# EAGLE design al3lg (EAGLE 7.2.0)

## Sheet 1 of 3
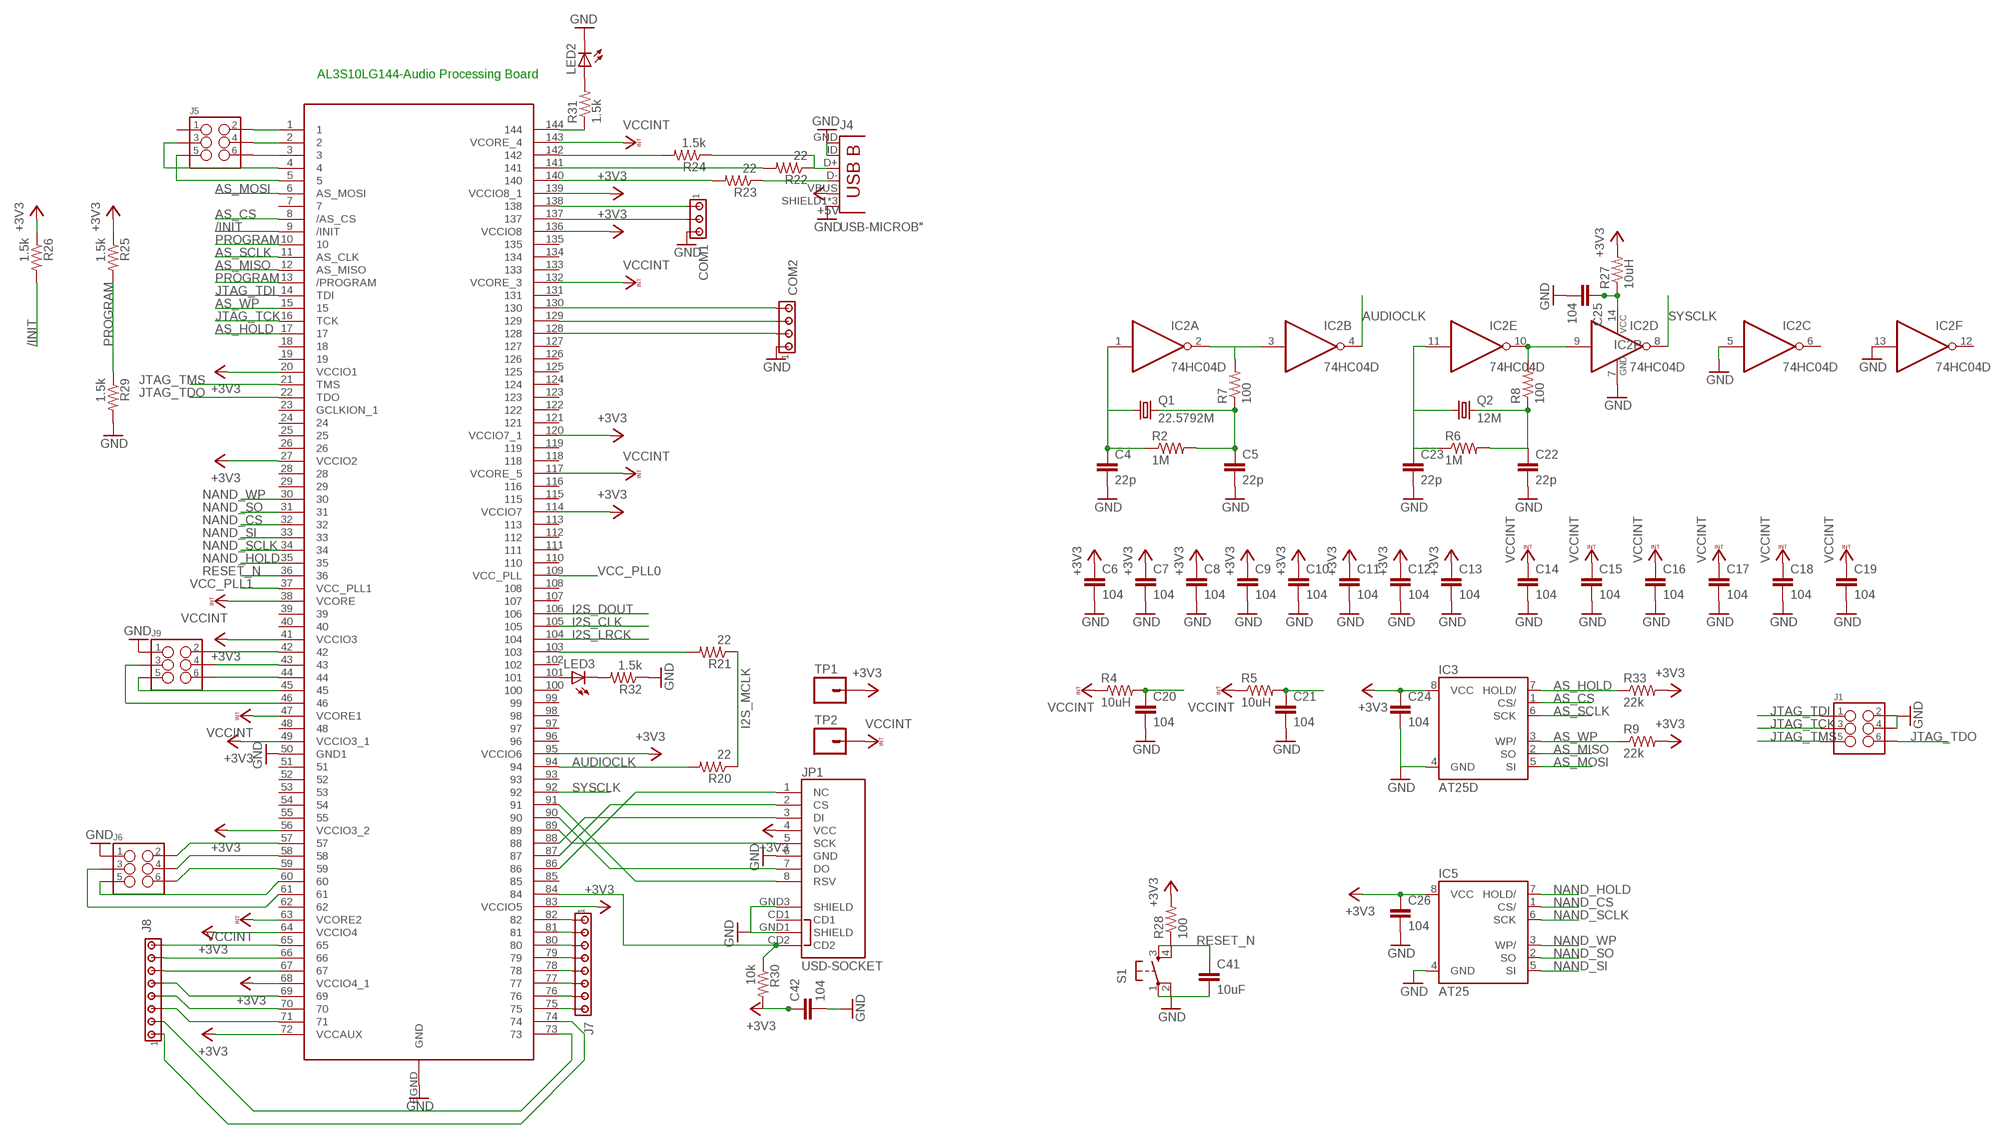
[diagram p0: schematic, sheet 1]

### Parts
C4  22p  C-EUC0805  [C0805]
C5  22p  C-EUC0805  [C0805]
C6  104  C-EUC0805  [C0805]
C7  104  C-EUC0805  [C0805]
C8  104  C-EUC0805  [C0805]
C9  104  C-EUC0805  [C0805]
C10  104  C-EUC0805  [C0805]
C11  104  C-EUC0805  [C0805]
C12  104  C-EUC0805  [C0805]
C13  104  C-EUC0805  [C0805]
C14  104  C-EUC0805  [C0805]
C15  104  C-EUC0805  [C0805]
C16  104  C-EUC0805  [C0805]
C17  104  C-EUC0805  [C0805]
C18  104  C-EUC0805  [C0805]
C19  104  C-EUC0805  [C0805]
C20  104  C-EUC0805  [C0805]
C21  104  C-EUC0805  [C0805]
C22  22p  C-EUC0805  [C0805]
C23  22p  C-EUC0805  [C0805]
C24  104  C-EUC0805  [C0805]
C25  104  C-EUC0805  [C0805]
C26  104  C-EUC0805  [C0805]
C41  10uF  C-EUC0805  [C0805]
C42  104  C-EUC0805  [C0805]
COM1  MTA03-100  [10X03MTA]
COM2  MTA04-100  [10X04MTA]
IC2  74HC04D  [SO14]
IC3  AT25D  [SOIC8]
IC5  AT25  [WSON8]
J1  M03X22X3_SILK_MALE_PTH  [2X3]
J4  USB-MICROB"  [USB-B-MICRO-SMD_V03]
J5  M03X22X3_SILK_MALE_PTH  [2X3]
J6  M03X22X3_SILK_MALE_PTH  [2X3]
J7  MTA08-100  [10X08MTA]
J8  MTA08-100  [10X08MTA]
J9  M03X22X3_SILK_MALE_PTH  [2X3]
JP1  USD-SOCKET  [MICROSD_1:1]
LED2  LEDSML0805  [SML0805]
LED3  LEDSML0805  [SML0805]
Q1  22.5792M  CRYSTALHC49S  [HC49/S]
Q2  12M  CRYSTALHC49S  [HC49/S]
R2  1M  R-US_M0805  [M0805]
R4  10uH  R-US_M0805  [M0805]
R5  10uH  R-US_M0805  [M0805]
R6  1M  R-US_M0805  [M0805]
R7  100  R-US_M0805  [M0805]
R8  100  R-US_M0805  [M0805]
R9  22k  R-US_M0805  [M0805]
R20  22  R-US_M0805  [M0805]
R21  22  R-US_M0805  [M0805]
R22  22  R-US_M0805  [M0805]
R23  22  R-US_M0805  [M0805]
R24  1.5k  R-US_M0805  [M0805]
R25  1.5k  R-US_M0805  [M0805]
R26  1.5k  R-US_M0805  [M0805]
R27  10uH  R-US_M0805  [M0805]
R28  100  R-US_M0805  [M0805]
R29  1.5k  R-US_M0805  [M0805]
R30  10k  R-US_M0805  [M0805]
R31  1.5k  R-US_R0805  [R0805]
R32  1.5k  R-US_R0805  [R0805]
R33  22k  R-US_M0805  [M0805]
S1  10-XXSMD  [B3F-10SMD]
TP1  M01  [0805SMD]
TP2  M01  [0805SMD]
U1  AL3S10LG144  [HLQFP144NT16]

### Nets
+3V3: C6.1 C7.1 C8.1 C9.1 C10.1 C11.1 C12.1 C13.1 C24.1 C26.1 C42.1 IC3.8(VCC) IC5.8(VCC) JP1.4(VCC) R9.2 R25.1 R26.1 R27.2 R28.2 R30.2 R33.2 TP1.1 U1.20(VCCIO1) U1.27(VCCIO2) U1.41(VCCIO3) U1.49(VCCIO3_1) U1.56(VCCIO3_2) U1.64(VCCIO4) U1.68(VCCIO4_1) U1.72(VCCAUX) U1.83(VCCIO5) U1.95(VCCIO6) U1.114(VCCIO7) U1.120(VCCIO7_1) U1.136(VCCIO8) U1.139(VCCIO8_1) ; also sheet 2
+5V: J4.VBUS ; also sheet 2,3
/INIT: R26.2 U1.9(/INIT)
AS_CS: IC3.1(CS/) U1.8(/AS_CS)
AS_HOLD: IC3.7(HOLD/) R33.1 U1.17
AS_MISO: IC3.2(SO) U1.12(AS_MISO)
AS_MOSI: IC3.5(SI) U1.6(AS_MOSI)
AS_SCLK: IC3.6(SCK) U1.11(AS_CLK)
AS_WP: IC3.3(WP/) R9.1 U1.15
AUDIOCLK: IC2.4(B:O) R20.2 U1.94
DI: J6.4 U1.58
DI1: J9.4 U1.43
DO: J6.2 U1.57
DO1: J9.2 U1.42
GND: C4.2 C5.2 C6.2 C7.2 C8.2 C9.2 C10.2 C11.2 C12.2 C13.2 C14.2 C15.2 C16.2 C17.2 C18.2 C19.2 C20.2 C21.2 C22.2 C23.2 C24.2 C25.2 C26.2 C41.2 C42.2 COM1.3 COM2.1 IC2.5(C:I) IC2.7(P:GND) IC2.13(F:I) IC3.4(GND) IC5.4(GND) J1.2 J1.4 J4.GND J4.ID(USBID) J4.SHIELD1(SHIELD) J4.SHIELD2(SHIELD) J4.SHIELD3(SHIELD) J6.1 J9.1 JP1.6(GND) JP1.GND1(SHIELD) JP1.GND3(SHIELD) LED2.C R29.2 R32.1 S1.1(P) S1.2(P1) U1.50(GND1) U1.EGND(GND) ; also sheet 2,3
I2S_CLK: U1.105 ; also sheet 3
I2S_DOUT: U1.106 ; also sheet 3
I2S_LRCK: U1.104 ; also sheet 3
I2S_MCLK: R20.1 R21.1 ; also sheet 3
JTAG_TCK: J1.3 U1.16(TCK)
JTAG_TDI: J1.1 U1.14(TDI)
JTAG_TDO: J1.6 U1.22(TDO)
JTAG_TMS: J1.5 U1.21(TMS)
LRCLK: J6.6 U1.59
LRCLK1: J9.6 U1.44
MCLK: J6.5 U1.60
MCLK1: J9.5 U1.45
N$2: C4.1 IC2.1(A:I) Q1.1 R2.1
N$3: C5.1 Q1.2 R2.2 R7.1
N$5: C23.1 IC2.11(E:I) Q2.1 R6.1
N$7: IC2.2(A:O) IC2.3(B:I) R7.2
N$8: C22.1 Q2.2 R6.2 R8.1
N$9: IC2.9(D:I) IC2.10(E:O) R8.2
N$25: R21.2 U1.103
N$26: R24.2 U1.142
N$27: J4.D+ R22.1 R24.1
N$28: R22.2 U1.141
N$29: R23.2 U1.140
N$30: J4.D- R23.1
N$31: COM1.1 U1.138
N$34: COM1.2 U1.137
N$35: C25.1 IC2.14(P:VCC) R27.1
N$37: J8.8 U1.65
N$38: J8.7 U1.66
N$39: J8.6 U1.67
N$40: J8.2 U1.73
N$41: J8.5 U1.69
N$42: J8.4 U1.70
N$43: J8.3 U1.71
N$45: J8.1 U1.74
N$46: J7.1 U1.82
N$47: J7.2 U1.81
N$48: J7.3 U1.80
N$49: J7.4 U1.79
N$50: J7.5 U1.78
N$51: J7.6 U1.77
N$52: J7.7 U1.76
N$53: JP1.CD2 R30.1 U1.84
N$54: JP1.8(RSV) U1.91
N$55: JP1.7(DO) U1.90
N$56: JP1.5(SCK) U1.89
N$57: JP1.3(DI) U1.88
N$58: JP1.2(CS) U1.87
N$59: JP1.1(NC) U1.86
N$60: COM2.4 U1.130
N$61: COM2.3 U1.129
N$62: COM2.2 U1.128
N$63: LED2.A R31.2
N$64: R31.1 U1.144
N$65: J5.2 U1.1
N$66: J5.4 U1.2
N$67: J5.6 U1.3
N$68: J5.3 U1.4
N$69: J5.5 U1.5
N$70: LED3.A U1.101
N$71: LED3.C R32.2
N$72: J7.8 U1.75
NAND_CS: IC5.1(CS/) U1.32
NAND_HOLD: IC5.7(HOLD/) U1.35
NAND_SCLK: IC5.6(SCK) U1.34
NAND_SI: IC5.5(SI) U1.33
NAND_SO: IC5.2(SO) U1.31
NAND_WP: IC5.3(WP/) U1.30
PROGRAM: R25.2 R29.1 U1.10 U1.13(/PROGRAM)
RESET_N: C41.1 R28.1 S1.3(S) S1.4(S1) U1.36
SCLK: J6.3 U1.61
SCLK1: J9.3 U1.46
SYSCLK: IC2.8(D:O) U1.92
VCC_PLL0: C21.1 R5.2 U1.109(VCC_PLL)
VCC_PLL1: C20.1 R4.2 U1.37(VCC_PLL1)
VCCINT: C14.1 C15.1 C16.1 C17.1 C18.1 C19.1 R4.1 R5.1 TP2.1 U1.38(VCORE) U1.47(VCORE1) U1.63(VCORE2) U1.117(VCORE_5) U1.132(VCORE_3) U1.143(VCORE_4) ; also sheet 2
Unconnected: IC2.6(C:O) IC2.12(F:O) J5.1 JP1.CD1 U1.7 U1.18 U1.19 U1.23(GCLKION_1) U1.24 U1.25 U1.26 U1.28 U1.29 U1.39 U1.40 U1.48 U1.51 U1.52 U1.53 U1.54 U1.55 U1.62 U1.85 U1.93 U1.96 U1.97 U1.98 U1.99 U1.100 U1.102 U1.107 U1.108 U1.110 U1.111 U1.112 U1.113 U1.115 U1.116 U1.118 U1.119 U1.121 U1.122 U1.123 U1.124 U1.125 U1.126 U1.127 U1.131 U1.133 U1.134 U1.135

### Notes on the sheet
- AL3S10LG144-Audio Processing Board

## Sheet 2 of 3
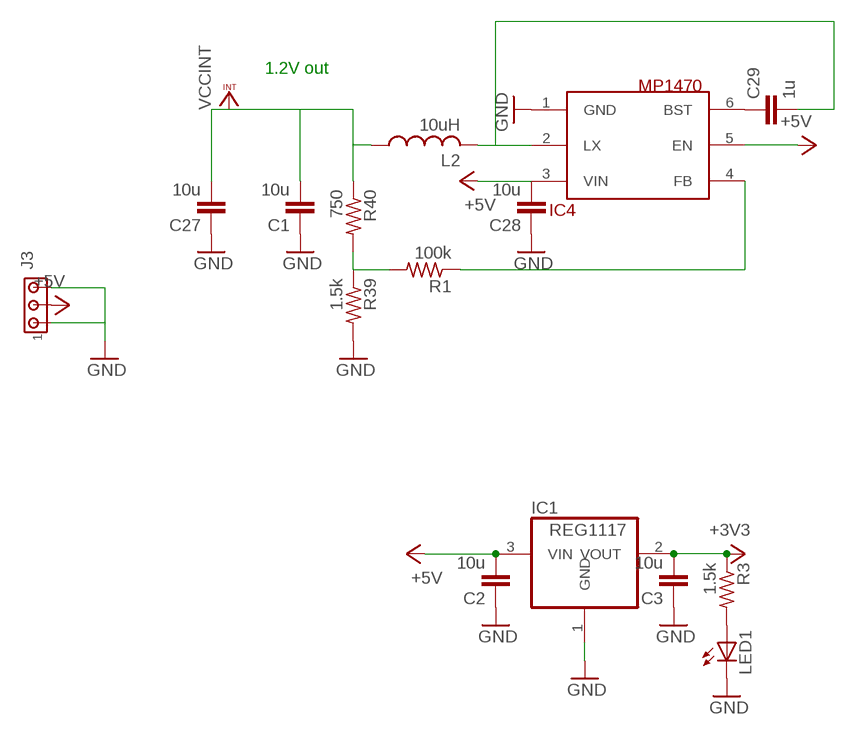
[diagram p1: schematic, sheet 2]

### Parts
C1  10u  C-EUC0805  [C0805]
C2  10u  C-EUC0805  [C0805]
C3  10u  C-EUC0805  [C0805]
C27  10u  C-EUC0805  [C0805]
C28  10u  C-EUC0805  [C0805]
C29  1u  C-EUC0805  [C0805]
IC1  REG1117  [SOT223]
IC4  MP1470  [SOT23-6L]
J3  MTA03-100  [10X03MTA]
L2  10uH  L-USL4532P  [L4532P]
LED1  LEDSML0805  [SML0805]
R1  100k  R-US_R0805  [R0805]
R3  1.5k  R-US_R0805  [R0805]
R39  1.5k  R-US_R0805  [R0805]
R40  750  R-US_R0805  [R0805]

### Nets
+3V3: C3.2 IC1.2(VOUT) R3.1 ; also sheet 1
+5V: C2.2 C28.2 IC1.3(VIN) IC4.3(VIN) IC4.5(EN) J3.2 ; also sheet 1,3
GND: C1.1 C2.1 C3.1 C27.1 C28.1 IC1.1(GND) IC4.1(GND) J3.1 J3.3 LED1.C R39.2 ; also sheet 1,3
N$1: R1.2 R39.1 R40.2
N$4: LED1.A R3.2
N$32: C29.2 IC4.2(LX) L2.2
N$33: C29.1 IC4.6(BST)
N$36: IC4.4(FB) R1.1
VCCINT: C1.2 C27.2 L2.1 R40.1 ; also sheet 1

### Notes on the sheet
- 1.2V out

## Sheet 3 of 3
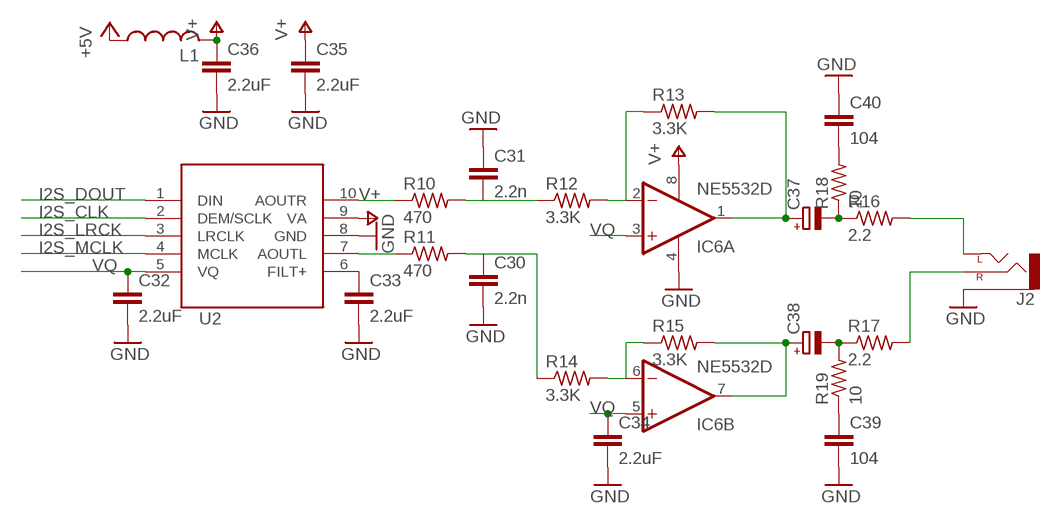
[diagram p2: schematic, sheet 3]

### Parts
C30  2.2n  C-EUC0805  [C0805]
C31  2.2n  C-EUC0805  [C0805]
C32  2.2uF  C-EUC0805  [C0805]
C33  2.2uF  C-EUC0805  [C0805]
C34  2.2uF  C-EUC0805  [C0805]
C35  2.2uF  C-EUC0805  [C0805]
C36  2.2uF  C-EUC0805  [C0805]
C37  CPOL-EUE2.5-7  [E2,5-7]
C38  CPOL-EUE2.5-7  [E2,5-7]
C39  104  C-EUC0805  [C0805]
C40  104  C-EUC0805  [C0805]
IC6  NE5532D  [SO08]
J2  AUDIO-JACKPTH  [AUDIO-JACK]
L1  L-USL4532P  [L4532P]
R10  470  R-US_R0805  [R0805]
R11  470  R-US_R0805  [R0805]
R12  3.3K  R-US_R0805  [R0805]
R13  3.3K  R-US_R0805  [R0805]
R14  3.3K  R-US_R0805  [R0805]
R15  3.3K  R-US_R0805  [R0805]
R16  2.2  R-US_R0805  [R0805]
R17  2.2  R-US_R0805  [R0805]
R18  10  R-US_R0805  [R0805]
R19  10  R-US_R0805  [R0805]
U2  CS4344  [TSSOP10]

### Nets
+5V: L1.1 ; also sheet 1,2
GND: C30.2 C31.1 C32.2 C33.2 C34.2 C35.2 C36.2 C39.2 C40.1 IC6.4(P:V-) J2.SLEEVE U2.8(GND) ; also sheet 1,2
I2S_CLK: U2.2(DEM/SCLK) ; also sheet 1
I2S_DOUT: U2.1(DIN) ; also sheet 1
I2S_LRCK: U2.3(LRCLK) ; also sheet 1
I2S_MCLK: U2.4(MCLK) ; also sheet 1
N$10: R11.1 U2.7(AOUTL)
N$11: C30.1 R11.2 R14.1
N$12: R10.1 U2.10(AOUTR)
N$13: C31.2 R10.2 R12.1
N$14: IC6.2(A:-IN) R12.2 R13.1
N$15: C37.+ IC6.1(A:OUT) R13.2
N$16: IC6.6(B:-IN) R14.2 R15.1
N$17: C38.+ IC6.7(B:OUT) R15.2
N$18: C33.1 U2.6(FILT+)
N$19: C37.- R16.1 R18.1
N$20: C38.- R17.1 R19.2
N$21: J2.TIP(LEFT) R16.2
N$22: J2.RING(RIGHT) R17.2
N$23: C39.1 R19.1
N$24: C40.2 R18.2
V+: C35.1 C36.1 IC6.8(P:V+) L1.2 U2.9(VA)
VQ: C32.1 C34.1 IC6.3(A:+IN) IC6.5(B:+IN) U2.5(VQ)

### Notes on the sheet
- U2

## Library data of the parts
C1-C36 C39-C42 = rcl:C-EU: CAPACITOR, European symbol
C37 C38 = rcl:CPOL-EU: POLARIZED CAPACITOR, European symbol
COM1 J3 = con-amp:MTA03-100: AMP connector
COM2 = con-amp:MTA04-100: AMP connector
IC1 = burr-brown:REG1117: 800mA and 1A Low Dropout (LDO) Positive Regulator 1.8V, 2.5V, 2.85V, 3.3V, 5V, and Adj; MPN: REG1117; OC_FARNELL: 1097566; OC_NEWARK: 14P6981
IC2 = 74xx-eu:74*04: Hex INVERTER
IC3 IC5 = atmel:AT25*: SPI bus serial EEPROM
IC4 = maxim:MP1470
IC6 = linear:NE5532: AUDIO AMPLIFIER
J1 J5 J6 J9 = SparkFun-Connectors:M03X2: 2x3 .1" header. Shrouded, with keying- CONN-10681 SMT- CONN-11415 Pogo pins- HW-11044; PROD_ID: CONN-09701
J2 = SparkFun-Connectors:AUDIO-JACK: 3.5mm Audio Jack Simple 3.5mm common PCB mount audio jack. Variant PTH is our storefront SKU PRT-08032
J4 = SparkFun-Connectors:USB-MICROB; PROD_ID: CONN-11752
J7 J8 = con-amp:MTA08-100: AMP connector
JP1 = SparkFun-Connectors:USD-SOCKET: microSD Socket Push-push type uSD socket. Schematic element and footprint production proven. Spark Fun Electronics SKU : PRT-00127. tDoc lines correctly indicate media card edge positions when inserting (unlocked, locked, depressed). NOTE: CD1 and CD2 are connected internally; PROD_ID: CONN-07820
L1 L2 = rcl:L-US: INDUCTOR, American symbol
LED1-LED3 = led:LED: LED OSRAM: - CHIPLED LG R971, LG N971, LY N971, LG Q971, LY Q971, LO R971, LY R971 LH N974, LH R974 LS Q976, LO Q976, LY Q976 LO Q996 - Hyper CHIPLED LW Q18S LB Q993, LB Q99A, LB R99A - SideLED LS A670, LO A670, LY A670, LG A670, LP A670 LB A673, LV A673, LT A673, LW A673 LH A674 LY A675 LS A676, LA A676, LO A676, LY A676, LW A676 LS A679, LY A679, LG A679 - Hyper Micro SIDELED® LS Y876, LA Y876, LO Y876, LY Y876 LT Y87S - SmartLED LW L88C, LW L88S LB L89C, LB L89S, LG L890 LS L89K, LO L89K, LY L89K LS L896, LA L896, LO L896, LY L896 - TOPLED LS T670, LO T670, LY T670, LG T670, LP T670 LSG T670, LSP T670, LSY T670, LOP T670, LYG T670 LG T671, LOG T671, LSG T671 LB T673, LV T673, LT T673, LW T673 LH T674 LS T676, LA T676, LO T676, LY T676, LB T676, LH T676, LSB T676, LW T676 LB T67C, LV T67C, LT T67C, LS T67K, LO T67K, LY T67K, LW E67C LS E67B, LA E67B, LO E67B, LY E67B, LB E67C, LV E67C, LT E67C LW T67C LS T679, LY T679, LG T679 LS T770, LO T770, LY T770, LG T770, LP T770 LB T773, LV T773, LT T773, LW T773 LH T774 LS E675, LA E675, LY E675, LS T675 LS T776, LA T776, LO T776, LY T776, LB T776 LHGB T686 LT T68C, LB T68C - Hyper Mini TOPLED® LB M676 - Mini TOPLED Santana® LG M470 LS M47K, LO M47K, LY M47K Source: http://www.osram.convergy.de LUXEON: - LUMILED® LXK2-PW12-R00, LXK2-PW12-S00, LXK2-PW14-U00, LXK2-PW14-V00 LXK2-PM12-R00, LXK2-PM12-S00, LXK2-PM14-U00 LXK2-PE12-Q00, LXK2-PE12-R00, LXK2-PE12-S00, LXK2-PE14-T00, LXK2-PE14-U00 LXK2-PB12-K00, LXK2-PB12-L00, LXK2-PB12-M00, LXK2-PB14-N00, LXK2-PB14-P00, LXK2-PB14-Q00 LXK2-PR12-L00, LXK2-PR12-M00, LXK2-PR14-Q00, LXK2-PR14-R00 LXK2-PD12-Q00, LXK2-PD12-R00, LXK2-PD12-S00 LXK2-PH12-R00, LXK2-PH12-S00 LXK2-PL12-P00, LXK2-PL12-Q00, LXK2-PL12-R00 Source: www.luxeon.com KINGBRIGHT: KA-3528ASYC Source: www.kingbright.com
Q1 Q2 = crystal:CRYSTAL: CRYSTAL; OC_FARNELL: 1667008; OC_NEWARK: unknown
R1-R33 R39 R40 = rcl:R-US_: RESISTOR, American symbol
S1 = switch-omron:10-XX: OMRON SWITCH
TP1 TP2 = SparkFun-Connectors:M01: Header 1 Standard 1-pin 0.1" header. Use with straight break away headers (SKU : PRT-00116), right angle break away headers (PRT-00553), swiss pins (PRT-00743), machine pins (PRT-00117), and female headers (PRT-00115). SMTSO-256-ET is a "flush mount" nut for a 4-40 screw. The older package used to be too tight, and did not allow it to sit properly thru the drill hit. The latest (0.165DIA) fits nice and snug.
U1 = anlogic:AL3S10LG144
U2 = cirrus-logic:CS4344

## Board
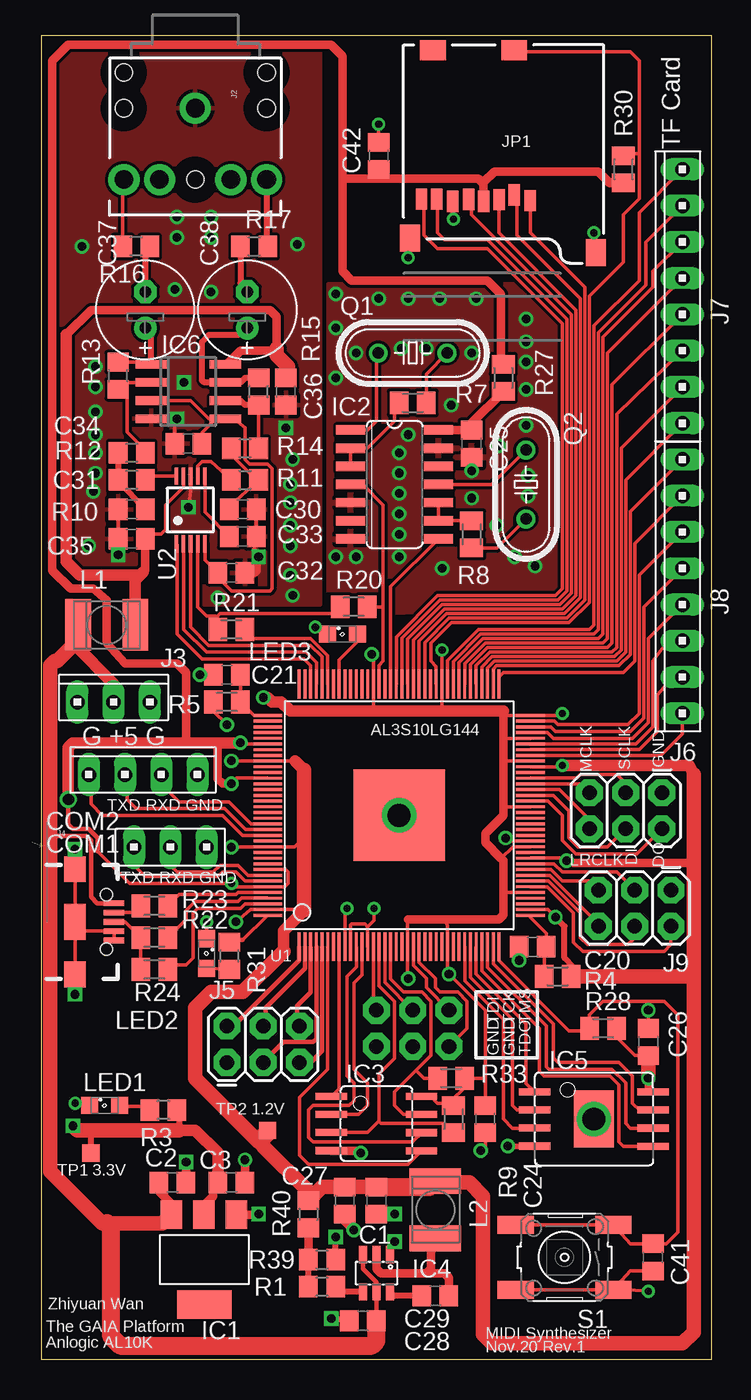
[diagram p3: board, top side]
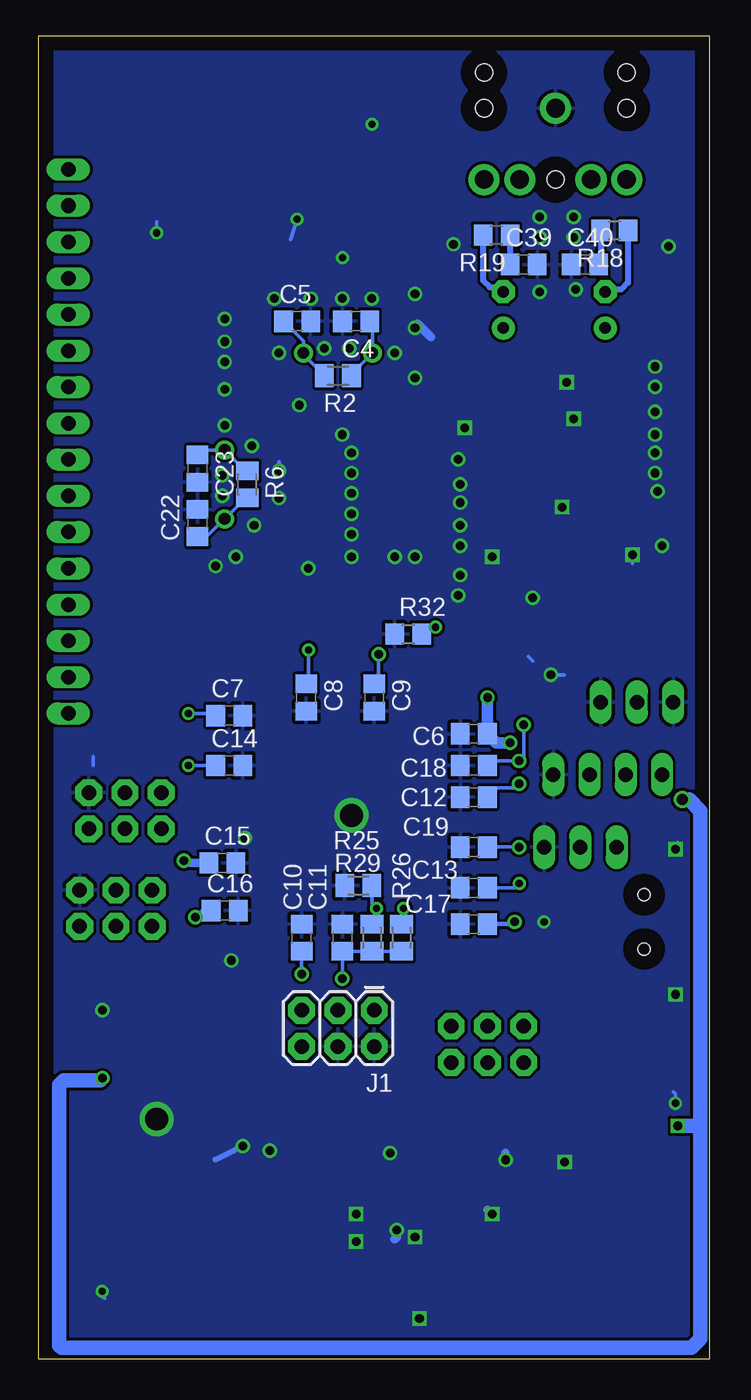
[diagram p4: board, bottom side, seen from below]

Size 46.99 x 92.71 mm. Coordinates in mm from the lower left corner, seen from the top.
Outline: 0,92.71 0,0 46.99,0 46.99,92.71 0,92.71
Copper layers (1*16): Top 0.035mm / dielectric 1.5mm / Bottom 0.035mm
Design rules "default": minimum track width 10mil, minimum drill 24mil, track to track 8mil, track to pad 8mil, pad to pad 8mil, via to via 8mil, smd to smd 8mil, copper to edge 40mil, drill to drill 8mil, minimum pad ring 10mil, minimum via ring 8mil, stop-mask expansion 4mil, vias tented up to drill 0mil, thermal gap 10mil

### Footprints (pad centres in the part's own frame; a part is rotated, then mirrored left to right if it is on the bottom)
C0805 = smd 1.3 x 1.5: 1 -0.95,0; 2 0.95,0
E2,5-7 = drill 0.813 pad 1.6: + -1.27,0 | drill 0.813 pad 1.6 octagon: - 1.27,0
10X03MTA = drill 1.016 long: 1 2.54,0; 2 0,0; 3 -2.54,0
10X04MTA = drill 1.016 long: 1 3.81,0; 2 1.27,0; 3 -1.27,0; 4 -3.81,0
SOT223 = smd 1.499 x 2.007: 1 -2.261,-3.15; 2 0.025,-3.15; 3 2.311,-3.15 | smd 3.81 x 2.007: 4 0,3.15
SO14 = smd 0.66 x 2.032: 1 -3.81,-3.073; 2 -2.54,-3.073; 3 -1.27,-3.073; 4 0,-3.073; 5 1.27,-3.073; 6 2.54,-3.073; 7 3.81,-3.073; 8 3.81,3.073; 9 2.54,3.073; 10 1.27,3.073; 11 0,3.073; 12 -1.27,3.073; 13 -2.54,3.073; 14 -3.81,3.073
SOIC8 = smd 0.5 x 2.2: 1 -1.905,-3.154; 2 -0.645,-3.154; 3 0.625,-3.154; 4 1.895,-3.154; 5 1.905,3.154; 6 0.635,3.154; 7 -0.635,3.154; 8 -1.905,3.154
SOT23-6L = smd 0.55 x 1.2: 1 -0.95,-1.3; 2 0,-1.3; 3 0.95,-1.3; 4 0.95,1.3; 5 0,1.3; 6 -0.95,1.3
WSON8 = smd 0.5 x 2.2: 1 -1.905,-4.154; 2 -0.645,-4.154; 3 0.625,-4.154; 4 1.895,-4.154; 5 1.905,4.154; 6 0.635,4.154; 7 -0.635,4.154; 8 -1.905,4.154 | smd 4 x 2.8: P$1 0,0
SO08 = smd 0.6 x 2.2: 1 -1.905,-2.6; 2 -0.635,-2.6; 3 0.635,-2.6; 4 1.905,-2.6; 5 1.905,2.6; 6 0.635,2.6; 7 -0.635,2.6; 8 -1.905,2.6
2X3 = drill 1.016 pad 1.88 octagon: 1 0,0; 2 0,2.54; 3 2.54,0; 4 2.54,2.54; 5 5.08,0; 6 5.08,2.54
AUDIO-JACK = drill 1.3 pad 2.184: RING 5,5; RSH 5,2.5; SLEEVE 0,0; TIP 5,-5; TSH 5,-2.5 | hole 1.2: 0,5; -2.5,5; -2.5,-5; 0,-5; 5,0
USB-B-MICRO-SMD_V03 = smd 1.45 x 0.4: D+ 2.725,0; D- 2.725,0.65; GND 2.725,-1.3; ID 2.725,-0.65; VBUS 2.725,1.3 | smd 1.5 x 1.8: SHIELD1 0,3.685; SHIELD2 0,-3.685 | smd 1.5 x 2.5: SHIELD3 0,0 | hole 0.85: 2.2,1.9; 2.2,-1.9
10X08MTA = drill 1.016 long: 1 8.89,0; 2 6.35,0; 3 3.81,0; 4 1.27,0; 5 -1.27,0; 6 -3.81,0; 7 -6.35,0; 8 -8.89,0
MICROSD_1:1 = smd 0.8 x 1.5: 1 5.096,10.919; 2 6.218,10.519; 3 7.274,10.853; 4 8.367,10.982; 5 9.421,10.828; 6 10.539,10.973; 7 11.648,10.819; 8 12.721,10.819 | smd 1.8 x 1.4: CD1 11.92,0.4; CD2 6.22,0.4 | smd 1.4 x 1.9: GND1 0.497,14.55; GND3 13.52,13.55
L4532P = smd 1.8 x 3.6: 1 -2,0; 2 2,0
SML0805 = smd 1.2 x 1.2: A 1.05,0; C -1.05,0
HC49/S = drill 0.813: 1 -2.413,0; 2 2.413,0
R0805 = smd 1.3 x 1.5: 1 -0.95,0; 2 0.95,0
M0805 = smd 1.3 x 1.6: 1 -0.95,0; 2 0.95,0
B3F-10SMD = smd 2.54 x 1.27: 1 -3.429,2.286; 2 3.429,2.286; 3 -3.429,-2.286; 4 3.429,-2.286
0805SMD = smd 1.2 x 1.2: 1 0,0
HLQFP144NT16 = smd 0.2 x 2: 1 -7,-9.2; 2 -6.6,-9.2; 3 -6.2,-9.2; 4 -5.8,-9.2; 5 -5.4,-9.2; 6 -5,-9.2; 7 -4.6,-9.2; 8 -4.2,-9.2; 9 -3.8,-9.2; 10 -3.4,-9.2; 11 -3,-9.2; 12 -2.6,-9.2; 13 -2.2,-9.2; 14 -1.8,-9.2; 15 -1.4,-9.2; 16 -1,-9.2; 17 -0.6,-9.2; 18 -0.2,-9.2; 19 0.2,-9.2; 20 0.6,-9.2; 21 1,-9.2; 22 1.4,-9.2; 23 1.8,-9.2; 24 2.2,-9.2; 25 2.6,-9.2; 26 3,-9.2; 27 3.4,-9.2; 28 3.8,-9.2; 29 4.2,-9.2; 30 4.6,-9.2; 31 5,-9.2; 32 5.4,-9.2; 33 5.8,-9.2; 34 6.2,-9.2; 35 6.6,-9.2; 36 7,-9.2; 73 7,9.2; 74 6.6,9.2; 75 6.2,9.2; 76 5.8,9.2; 77 5.4,9.2; 78 5,9.2; 79 4.6,9.2; 80 4.2,9.2; 81 3.8,9.2; 82 3.4,9.2; 83 3,9.2; 84 2.6,9.2; 85 2.2,9.2; 86 1.8,9.2; 87 1.4,9.2; 88 1,9.2; 89 0.6,9.2; 90 0.2,9.2; 91 -0.2,9.2; 92 -0.6,9.2; 93 -1,9.2; 94 -1.4,9.2; 95 -1.8,9.2; 96 -2.2,9.2; 97 -2.6,9.2; 98 -3,9.2; 99 -3.4,9.2; 100 -3.8,9.2; 101 -4.2,9.2; 102 -4.6,9.2; 103 -5,9.2; 104 -5.4,9.2; 105 -5.8,9.2; 106 -6.2,9.2; 107 -6.6,9.2; 108 -7,9.2 | smd 2 x 0.2: 37 9.2,-7; 38 9.2,-6.6; 39 9.2,-6.2; 40 9.2,-5.8; 41 9.2,-5.4; 42 9.2,-5; 43 9.2,-4.6; 44 9.2,-4.2; 45 9.2,-3.8; 46 9.2,-3.4; 47 9.2,-3; 48 9.2,-2.6; 49 9.2,-2.2; 50 9.2,-1.8; 51 9.2,-1.4; 52 9.2,-1; 53 9.2,-0.6; 54 9.2,-0.2; 55 9.2,0.2; 56 9.2,0.6; 57 9.2,1; 58 9.2,1.4; 59 9.2,1.8; 60 9.2,2.2; 61 9.2,2.6; 62 9.2,3; 63 9.2,3.4; 64 9.2,3.8; 65 9.2,4.2; 66 9.2,4.6; 67 9.2,5; 68 9.2,5.4; 69 9.2,5.8; 70 9.2,6.2; 71 9.2,6.6; 72 9.2,7; 109 -9.2,7; 110 -9.2,6.6; 111 -9.2,6.2; 112 -9.2,5.8; 113 -9.2,5.4; 114 -9.2,5; 115 -9.2,4.6; 116 -9.2,4.2; 117 -9.2,3.8; 118 -9.2,3.4; 119 -9.2,3; 120 -9.2,2.6; 121 -9.2,2.2; 122 -9.2,1.8; 123 -9.2,1.4; 124 -9.2,1; 125 -9.2,0.6; 126 -9.2,0.2; 127 -9.2,-0.2; 128 -9.2,-0.6; 129 -9.2,-1; 130 -9.2,-1.4; 131 -9.2,-1.8; 132 -9.2,-2.2; 133 -9.2,-2.6; 134 -9.2,-3; 135 -9.2,-3.4; 136 -9.2,-3.8; 137 -9.2,-4.2; 138 -9.2,-4.6; 139 -9.2,-5; 140 -9.2,-5.4; 141 -9.2,-5.8; 142 -9.2,-6.2; 143 -9.2,-6.6; 144 -9.2,-7 | smd 6.4 x 6.4: EGND 0,0
TSSOP10 = smd 0.25 x 1.2: 1 -1,-2.25; 2 -0.5,-2.25; 3 0,-2.25; 4 0.5,-2.25; 5 1,-2.25; 6 1,2.5; 7 0.5,2.5; 8 0,2.5; 9 -0.5,2.5; 10 -1,2.5

### Placement (x,y rotation side)
C1  23.5,11.11 90 top
C2  9.21,12.38 180 top
C3  13.34,12.38 180 top
C4  24.77,72.71 180 bottom
C5  28.89,72.71 0 bottom
C6  16.51,43.81 180 bottom
C7  33.66,45.09 0 bottom
C8  28.26,46.35 270 bottom
C9  23.5,46.35 270 bottom
C10  28.57,29.53 90 bottom
C11  25.72,29.53 90 bottom
C12  16.51,39.37 180 bottom
C13  16.51,33.02 180 bottom
C14  33.66,41.59 0 bottom
C15  34.13,34.77 0 bottom
C16  33.97,31.43 0 bottom
C17  16.51,30.48 180 bottom
C18  16.51,41.59 180 bottom
C19  16.51,35.88 180 bottom
C20  34.45,28.89 180 top
C21  13.02,47.94 180 top
C22  35.88,58.58 90 bottom
C23  35.88,62.39 270 bottom
C24  31.11,16.83 270 top
C25  30.16,64.14 270 top
C26  42.55,22.23 90 top
C27  21.27,11.11 90 top
C28  22.54,2.7 0 top
C29  27.62,4.45 0 top
C30  14.13,59.53 0 top
C31  6.35,59.53 0 top
C32  13.34,55.09 0 top
C33  14.13,57.63 0 top
C34  10.32,64.14 180 top
C35  6.35,57.47 180 top
C36  17.14,67.79 270 top
C37  7.3,73.5 90 top
C38  14.45,73.5 90 top
C39  13.02,76.68 0 bottom
C40  8.73,76.68 0 bottom
C41  42.86,7.14 270 top
C42  23.65,84.3 90 top
COM1  9.05,35.88 180 top
COM2  7.14,40.96 0 top
IC1  11.43,6.99 180 top
IC2  24.77,61.28 270 top
IC3  23.5,16.51 270 top
IC4  23.5,6.03 180 top
IC5  38.73,16.83 270 top
IC6  10.32,67.79 270 top
J1  23.5,24.45 180 bottom
J2  10.79,87.63 270 top
J3  5.08,46.04 0 top
J4  2.38,30.64 0 top
J5  13.02,20.8 0 top
J6  43.5,39.69 180 top
J7  44.93,74.45 90 top
J8  44.93,54.13 90 top
J9  44.13,32.86 180 top
JP1  39.37,92.08 180 top
L1  4.6,51.44 0 top
L2  27.62,10.48 270 top
LED1  4.45,17.78 0 top
LED2  11.59,28.42 270 top
LED3  21.11,50.8 0 top
Q1  26.04,70.48 0 top
Q2  33.97,61.28 270 top
R1  19.68,5.08 180 top
R2  26.04,68.9 180 bottom
R3  8.57,17.46 180 top
R4  36.2,26.83 180 top
R5  13.02,46.04 0 top
R6  32.38,61.28 270 bottom
R7  26.04,66.99 180 top
R8  30.16,57.78 90 top
R9  28.89,16.83 90 top
R10  6.35,61.59 180 top
R11  14.29,61.59 0 top
R12  6.35,63.5 0 top
R13  5.4,68.9 90 top
R14  14.29,63.82 0 top
R15  15.24,67.79 90 top
R16  6.67,77.95 180 top
R17  14.92,77.95 0 top
R18  6.67,79.06 180 bottom
R19  14.92,78.74 180 bottom
R20  21.91,52.7 0 top
R21  13.34,51.12 0 top
R22  7.94,29.53 0 top
R23  7.94,31.75 0 top
R24  7.94,27.3 0 top
R25  23.65,29.53 90 bottom
R26  21.59,29.53 90 bottom
R27  32.38,68.74 90 top
R28  39.37,23.18 0 top
R29  24.61,33.18 180 bottom
R30  40.8,83.34 270 top
R31  13.18,28.26 270 top
R32  21.11,50.8 0 bottom
R33  28.73,19.68 0 top
R39  19.68,6.99 0 top
R40  18.73,10.16 270 top
S1  36.67,7.14 180 top
TP1  3.49,14.45 0 top
TP2  15.88,16.03 0 top
U1  25.08,38.1 0 top
U2  10.48,59.37 0 top

### Tracks (layer width: path | path; a pad name or v marks a point on that pad's centre or on a via)
+3V3  (via drill 0.5, 0.6, 0.8)
  Top 0.254: U1.114 14.05,43.1 v13.97,43.18 | U1.120 13.71,40.7 v13.34,40.32 | v28.1,49.69 28.08,49.23 U1.83 28.08,45.58 28.26,45.4 | 23.18,45.4 23.28,45.51 U1.95 23.28,49.27 v23.18,49.37 | 32.38,45.4 32.7,45.09 32.72,45.1 U1.72 34.3,45.09 36.35,45.09 v36.51,45.24 | U1.64 32.4,41.9 | 32.4,41.9 32.38,41.91 | U1.41 32.39,32.7 32.38,32.7 | U1.49 33.04,35.9 32.23,35.08 | 32.38,38.73 32.42,38.7 U1.56 | 32.4,41.9 32.4,38.43 32.38,38.42 | v25.72,26.67 25.68,27.02 U1.20 25.68,30.45 25.72,30.8 | 28.26,30.8 28.48,30.39 U1.27 28.48,27.08 v28.57,26.99 31.11,24.45 31.11,19.68 | IC3.8 26.67,18.44 27.28,18.44 27.78,17.94 28.73,17.94 | IC5.8 42.23,18.76 42.57,18.76 | U1.136 17.14,34.3 17.3,34.13 17.3,33.34 17.07,33.1 U1.139 13.57,33.1 v13.34,33.34 6.19,33.34 3.97,35.56 | C26.1 41.59,21.27 40.32,22.54 R28.2 | C42.1 24.29,83.03 23.97,82.71 | 31.11,19.68 R33.2 29.69,19.05 28.73,18.09 28.73,17.94 | 31.11,19.68 C24.1 | 28.73,17.94 R9.2 | U1.68 32.39,43.5 32.38,43.5
  Top 0.305: 3.97,35.56 3.97,36.51 3.33,37.15 2.22,37.15 1.91,37.47 v1.91,39.21
  Top 0.406: R3.1 9.68,17.14 9.68,16.03 | TP1.1 3.49,15.88 3.65,16.03
  Top 0.61: IC1.2 11.4,10.77 12.06,11.43 12.06,12.06 C3.2 | 32.38,45.4 32.38,43.5 32.38,38.73 32.38,38.42 32.38,38.1 31.11,36.83 31.11,36.2 32.23,35.08 32.38,34.92 32.38,32.7 32.38,31.11 32.07,30.8 28.26,30.8 25.72,30.8 | 42.57,18.76 42.57,19.66 v42.55,19.68 | v13.34,40.32 12.7,40.32 12.38,40.64 12.38,43.18 | 10.16,43.18 10.16,48.1 9.53,48.74 5.87,48.74 4.6,50.16 4.6,53.18 3.65,53.98 2.06,53.98 0.79,55.24 0.79,90.96 1.91,92.08 20.32,92.08 21.11,91.28 21.11,82.71 | 21.11,82.71 21.11,76.2 21.75,75.56 31.27,75.56 32.23,74.61 32.23,69.85 R27.2 | JP1.4 31,82.34 | 31,82.34 30.64,82.71 23.97,82.71 21.11,82.71 | 31,82.34 31,82.44 31.75,83.19 39.05,83.19 39.85,82.39 R30.2
  Top 0.813: C3.2 12.38,14.44 10.79,16.03 9.68,16.03 | v13.97,43.18 12.38,43.18 10.16,43.18 2.22,43.18 1.91,42.86 v1.91,39.21 | v15.56,46.35 15.88,46.35 16.19,46.04 16.83,46.04 17.46,45.4 23.18,45.4 28.26,45.4 32.38,45.4
  Top 1.016: C26.1 v42.55,19.68 | 9.68,16.03 3.65,16.03 2.54,16.03 v2.22,16.35
  Bottom 0.254: v13.34,40.32 13.65,40.01 14.93,40.01 C12.1 | 15.24,43.5 C6.1 | v23.18,49.37 23.18,47.62 C9.1 | v28.1,49.69 28.1,47.62 C8.1 | v25.72,26.67 C11.1 R25.1 R26.1 | v28.57,26.99 C10.1 | C13.1 13.65,33.02 v13.34,33.34 | v36.51,45.24 34.76,45.24 C7.1
  Bottom 0.813: v13.97,43.18 14.93,43.18 C6.1 15.56,45.72 v15.56,46.35
  Bottom 1.016: 0.95,16.35 0.64,16.67 0.64,38.42 1.43,39.21 v1.91,39.21 | 0.95,16.35 0.79,16.35 0.64,16.51 0.64,1.43 1.27,0.79 45.4,0.79 45.56,0.95 45.56,19.21 45.24,19.53 42.7,19.53 v42.55,19.68 | v2.22,16.35 0.95,16.35
+5V
  Top 0.305: C28.2 IC4.5 23.5,5.4 22.55,6.35 IC4.3 | 0.64,36.99 0.95,36.67 3.17,36.67 3.49,36.35 3.49,32.38 3.94,31.94 J4.VBUS
  Top 0.61: IC1.3 9.12,10.88 8.26,11.75 C2.2 | 2.44,51.59 L1.1
  Top 0.813: J3.2 5.08,47.31 2.3,50.09
  Top 1.016: L1.1 2.6,50.39 2.3,50.09 1.11,48.9 0.95,48.9 0.64,48.58 0.64,36.99 0.64,13.18 4.29,9.53 4.6,9.53 8.51,9.53 IC1.3
  Top 1.27: C28.2 23.5,2.85 23.5,1.27 23.18,0.95 5.56,0.95 4.92,1.59 4.92,9.21 4.6,9.53 | 2.6,50.39 2.6,50.26
/INIT  (via drill 0.5)
  Top 0.254: U1.9 21.28,31.28 v21.43,31.59
  Bottom 0.254: v21.43,31.59 21.43,30.64 R26.2
AS_CS
  Top 0.254: U1.8 20.88,18.96 IC3.1
AS_HOLD
  Top 0.254: IC3.7 25.4,17.14 24.77,17.78 24.77,18.73 26.27,20.24 | U1.17 24.48,26.64 25.4,25.72 26.67,25.72 27.3,25.08 27.3,21.27 26.27,20.24 | R33.1 26.83,19.68 26.27,20.24
AS_MISO
  Top 0.254: 20.67,17.14 IC3.2 20.35,17.14 22.23,17.14 22.86,17.78 22.86,19.37 21.91,20.32 21.91,26.35 22.48,26.93 U1.12
AS_MOSI
  Top 0.254: U1.6 20.08,20.32 18.1,18.34 18.1,14.29 18.73,13.65 25.7,13.65 IC3.5
AS_SCLK
  Top 0.254: IC3.6 26.67,15.88 26.04,15.24 19.05,15.24 18.73,15.56 18.73,17.46 19.05,17.78 21.59,17.78 21.91,18.1 21.91,19.37 21.43,19.84 21.43,26.83 22.08,27.48 U1.11
AS_WP
  Top 0.254: IC3.3 22.87,15.88 23.68,16.7 | U1.15 23.68,26.16 24.77,25.08 24.77,21.09 23.68,20 23.68,16.7 | 23.68,16.7 23.68,16.64 23.81,16.51 28.26,16.51 R9.1
AUDIOCLK
  Top 0.254: IC2.4 22.54,61.28 23.97,59.85 23.97,52.7 | U1.94 23.68,48.61 23.97,48.9 23.97,52.7 | R20.2 23.97,52.7
DI
  Top 0.254: U1.58 35.91,39.5 36.99,38.42 36.99,36.51 37.62,35.88 39.69,35.88 J6.4
DI1
  Top 0.254: U1.43 35.56,33.5 37.78,31.27 37.78,29.53 38.26,29.05 41.12,29.05 41.59,29.53 J9.4
DO
  Top 0.254: U1.57 35.51,39.1 36.51,38.1 36.51,36.35 37.47,35.4 41.75,35.4 J6.2
DO1
  Top 0.254: J9.2 44.13,29.05 43.66,28.57 37.94,28.57 37.31,29.21 37.31,31.27 35.48,33.1 U1.42
GND  (via drill 0.5, 0.6, 1.6)
  Top 0.254: U1.50 32.81,36.3 v32.54,36.51 | C21.2 v11.11,47.94 | C24.2 31.11,14.92 v30.8,14.61 | C25.2 v30.16,62.23 | C26.2 v42.55,24.45 | C30.2 C33.2 | U2.8 10.48,60.8 v10.32,59.69 | v5.4,56.36 C35.2 C31.1 | C34.2 9.37,65.72 v9.53,65.88 | v2.38,25.56 2.22,25.72 J4.SHIELD2 J4.SHIELD3 | 2.22,34.61 J4.SHIELD1 J4.SHIELD3 | 2.22,34.61 2.22,35.56 v2.38,35.72 2.06,35.4 2.06,34.77 2.22,34.61 | J4.GND J4.ID 2.87,29.99 J4.SHIELD3 | C41.2 41.28,6.19 S1.1 | S1.1 S1.2 | S1.1 41.18,4.86 v42.55,4.76 | JP1.GND1 38.87,78.76 v38.73,78.9 | JP1.6 28.83,79.91 v28.89,79.85 | JP1.GND3 25.85,77.34 v25.72,77.15 | C42.2 23.66,85.41 v23.65,86.52 | LED1.C 2.54,17.78 v2.38,17.94 | LED2.C v11.59,30.64
  Top 0.406: C1.1 v24.76,10.16 v24.77,10.16 | R39.2 20.64,7.3 v20.64,8.57 | IC4.1 24.45,7.93 v24.77,8.26 | C28.1 v20.32,2.86 | C20.2 v33.5,27.94 | IC5.4 34.58,14.9 v32.7,14.92 | IC6.4 v9.53,65.88 | v15.24,56.2 14.92,56.67
  Top 0.61: v15.24,10.16 15.21,10.13 IC1.1 13.4,9.84 13.34,9.84 | C2.1 v10.16,13.81 | C3.1 v14.29,13.97 | IC3.4 22.21,14.62 | C27.1 21.27,9.68 v21.91,9.05 | C32.2 14.92,55.09 15.08,55.24 15.08,56.36 v15.24,56.2 | 22.06,14.62 v22.38,14.45 22.21,14.62 | 22.21,14.62 22.07,14.61
  Bottom 0.254: 43.18,41.59 43.18,42.23 | 12.7,49.21 12.38,48.9 | v11.11,47.94 10.16,47.94 | v30.8,14.61 31.11,14.92 | v30.16,62.23 30.16,62.87 | v10.32,59.69 10.48,59.85 | v5.4,56.36 5.4,55.72 | v2.38,25.56 2.38,25.24 | v2.38,35.72 2.38,36.04 2.22,36.2 | v42.55,4.76 42.7,4.45 42.39,4.29 | v38.73,78.9 38.73,79.69 | v28.89,79.85 29.37,78.42 | v23.65,86.52 23.5,86.68 23.65,86.68 | v2.38,17.94 2.38,18.57 2.54,18.73
  Bottom 0.406: v24.77,10.16 24.77,9.84 | v24.77,8.26 25.08,8.57 | v32.7,14.92 34.61,13.97
  Bottom 0.61: v15.24,10.16 15.56,10.48 | v10.16,13.81 10.32,13.97 10.32,13.81 | v14.29,13.97 14.29,14.45 | v21.91,9.05 21.91,8.57 22.07,8.41 | 19.53,71.6 20.48,72.55
  other vias: 25.08,38.1 22.07,56.2 17.46,61.28 17.62,63.02 30.16,70.48 22.07,70.48 20.64,68.74 20.64,74.61 28.73,66.83 17.46,54.93 20.64,72.23 26.99,70.8 25.24,70.8 34.13,61.91 34.13,60.48 33.18,56.2 28.1,55.4 34.61,55.56 25.08,56.2 25.08,57.78 25.08,59.21 25.08,60.64 25.08,62.07 25.08,63.5 25.72,64.77 30.16,60.33 31.91,58.42 32.07,63.98 33.97,65.41 17.14,65.25 10,68.42 17.46,60.01 17.46,58.42 17.46,56.99 17.62,53.5 12.38,53.34 3.81,64.77 3.81,63.5 3.81,62.07 3.65,60.8 3.81,66.36 3.81,68.1 3.81,69.53 3.33,56.99 38.73,16.83 33.97,67.94 33.97,69.85 33.97,71.28 33.97,72.87 30.48,74.3 20.64,56.2 25.72,74.3 27.94,74.3 23.65,74.3 9.53,80.01 11.91,80.01 9.37,74.93 11.91,74.77 9.53,78.58 11.91,78.58 17.94,78.11 2.86,77.95
  pour Bottom: 0.48,92.55 0.32,0.32 46.04,0 46.35,92.55
  pour Top: 20.16,75.25 20.16,52.23 37.47,52.7 37.15,75.25
  pour Top: 0.95,92.39 0.95,55.24 8.89,55.24 8.89,57.78 11.27,57.78 11.27,52.86 19.53,52.86 19.53,92.71
I2S_CLK
  Top 0.254: U1.105 19.28,48.82 18.57,49.53 11.59,49.53 10,51.12 10,57.1 U2.2
I2S_DOUT
  Top 0.254: U1.106 18.88,48.59 18.41,49.05 11.27,49.05 9.53,50.8 9.53,57.08 U2.1
I2S_LRCK
  Top 0.254: U1.104 19.68,49.22 18.89,50.01 11.75,50.01 10.48,51.28 U2.3
I2S_MCLK
  Top 0.254: U2.4 10.98,52.68 11.59,52.07 12.22,52.07 12.38,51.91 | R20.1 20.96,52.55 20.48,52.23 12.54,52.23 12.38,52.07 12.38,51.91 | 12.38,51.91 R21.1
JTAG_TCK
  Top 0.254: U1.16 24.08,26.4 J1.3
JTAG_TDI
  Top 0.254: U1.14 23.28,24.66 J1.1
JTAG_TDO
  Top 0.254: U1.22 26.48,27.81 27.62,26.67 27.62,26.04 27.94,25.72 29.21,25.72 29.84,25.08 29.84,23.18 J1.6
JTAG_TMS
  Top 0.254: U1.21 26.08,27.57 26.99,26.67 26.99,26.04 J1.5
LRCLK
  Top 0.254: U1.59 36.3,39.9 38.26,37.94 38.26,37.31 J6.6
LRCLK1
  Top 0.254: U1.44 35.63,33.9 38.73,30.8 38.73,30.64 J9.6
MCLK
  Top 0.254: U1.60 37.8,40.3 J6.5
MCLK1
  Top 0.254: U1.45 35.71,34.3 36.51,33.5 38.42,33.5 J9.5
N$1
  Top 0.406: R1.2 R39.1
  Top 0.61: R40.2 R39.1
N$2
  Top 0.254: IC2.1 22.86,65.09 23.5,65.72 23.5,70.36 Q1.1
  Bottom 0.254: R2.1 25.09,69.02 Q1.1 23.62,72.51 C4.1
N$3
  Top 0.254: R7.1 26.98,69.02 Q1.2
  Bottom 0.254: R2.2 28.45,70.36 Q1.2 28.45,71.31 C5.1
N$4
  Top 0.254: R3.2 7.08,17.72 5.55,17.72 LED1.A
N$5
  Top 0.254: IC2.11 31.56,61.28 Q2.1
  Bottom 0.254: R6.1 32.51,62.23 Q2.1 35.44,63.69 C23.1
N$7
  Top 0.254: R7.2 24.77,66.67 24.77,65.72 22.86,63.82 IC2.2 IC2.3
N$8
  Top 0.254: R8.1 31.94,56.84 Q2.2
  Bottom 0.254: R6.2 32.51,60.33 Q2.2 34,58.86 35.4,57.47 35.72,57.47 C22.1
N$9
  Top 0.254: IC2.10 IC2.9 R8.2
N$10
  Top 0.254: 13.34,61.75 R11.1 11.91,62.87 11.27,62.87 10.98,62.57 U2.7
N$11
  Top 0.254: C30.1 13.18,59.7 R11.2 14.92,61.75 15.08,61.59 13.34,63.34 R14.1
N$12
  Top 0.254: U2.10 7.58,61.87 R10.1
N$13
  Top 0.406: C31.2 R10.2 R12.1
N$14
  Top 0.254: IC6.2 5.87,68.42 R13.1 6.03,67.31 6.03,64.93 7.46,63.5 R12.2
N$15
  Top 0.254: R13.2 7.56,69.85 IC6.1
  Top 0.406: IC6.1 7.72,71.81 C37.+
N$16
  Top 0.254: R14.2 15.24,63.66 R15.1
  Top 0.406: R15.1 14.29,66.84 13.97,67.15 IC6.6
N$17
  Top 0.406: C38.+ 13.81,71.75 11.75,71.75 11.27,71.28 11.27,68.58 11.43,68.42 IC6.7 13.97,68.42 14.29,68.74 R15.2
N$18
  Top 0.254: U2.6 11.48,59.33 C33.1
N$19
  Top 0.406: R16.1 7.3,77.95 C37.-
  Bottom 0.406: R18.1 5.72,75.4 6.19,74.93 7.14,74.93 C37.-
N$20
  Top 0.406: R17.1 13.97,75.4 C38.-
  Bottom 0.406: R19.2 15.87,75.56 15.4,75.09 14.61,75.09 C38.-
N$21
  Top 0.254: 5.72,77.87 5.72,82.55 J2.TIP
  Top 0.406: 5.72,77.87 R16.2
N$22
  Top 0.406: J2.RING 15.79,78.34 R17.2
N$23
  Bottom 0.406: R19.1 C39.1
N$24
  Bottom 0.406: R18.2 7.62,76.84 C40.2
N$25
  Top 0.254: U1.103 20.08,49.29 18.89,50.48 14.6,50.48 R21.2
N$26
  Top 0.254: U1.142 14.28,31.9 13.97,31.59 10.95,31.59 10.64,31.27 10.64,28.1 10.16,27.62 9.21,27.62 R24.2
N$27
  Top 0.254: J4.D+ 5.88,30.64 R22.1 R24.1
N$28
  Top 0.254: U1.141 14.04,32.3 13.81,32.07 10.79,32.07 10.16,31.43 10.16,30.8 R22.2
N$29
  Top 0.254: U1.140 13.81,32.7 13.65,32.54 9.68,32.54 R23.2
N$30
  Top 0.254: J4.D- 6.53,31.29 R23.1
N$31
  Top 0.254: U1.138 14.28,33.5 13.65,34.13 12.7,34.13 12.38,33.81 7.3,33.81 6.51,34.61 COM1.1
N$32
  Top 0.61: IC4.2 23.5,6.35 23.81,6.03 26.99,6.03 | 26.99,6.03 27.3,6.35 27.3,7.53 L2.2 | 26.99,6.03 28.26,6.03 28.57,5.71 C29.2
N$33
  Top 0.406: C29.1 24.73,4.45 IC4.6
N$34
  Top 0.254: U1.137 14.52,33.9 13.81,34.61 12.54,34.61 12.06,34.13 9.53,34.13 9.05,34.61 COM1.2
N$35
  Top 0.61: IC2.14 C25.1 30.16,65.57 R27.1
N$36
  Top 0.406: IC4.4 20.98,4.73 R1.1
N$37
  Top 0.254: J8.8 44.93,43.81 43.41,42.3 U1.65
N$38
  Top 0.254: U1.66 41.91,42.7 43.18,43.97 43.18,46.51 44.13,47.62 44.77,47.62 J8.7
N$39
  Top 0.254: U1.67 41.67,43.1 42.86,44.29 42.86,48.9 43.81,50.16 44.77,50.16 J8.6
N$40
  Top 0.254: 32.08,46.98 U1.73 32.08,47.8 32.38,48.1 40.8,48.1 41.59,48.9 41.59,57.15 J8.2
N$41
  Top 0.254: J8.5 42.55,50.48 42.55,44.61 41.43,43.5 35.88,43.5 35.48,43.9 U1.69
N$42
  Top 0.254: J8.4 42.23,52.7 42.23,44.93 41.27,43.97 36.04,43.97 35.71,44.3 U1.70
N$43
  Top 0.254: J8.3 41.91,54.93 41.91,45.24 41.12,44.45 36.2,44.45 35.95,44.7 U1.71
N$45
  Top 0.254: U1.74 31.68,48.35 31.91,48.58 40.48,48.58 41.27,49.37 41.27,59.37 J8.1
N$46
  Top 0.254: U1.82 28.48,48.96 30.64,51.12 38.42,51.12 38.73,51.44 38.73,72.39 41.91,75.56 41.91,80.33 J7.1
N$47
  Top 0.254: U1.81 28.88,48.88 30.8,50.8 38.73,50.8 39.05,51.12 39.05,71.91 42.39,75.25 42.39,78.26 J7.2
N$48
  Top 0.254: U1.80 29.28,48.81 30.96,50.48 39.05,50.48 39.37,50.8 39.37,71.6 42.86,75.09 42.86,76.2 J7.3
N$49
  Top 0.254: U1.79 29.68,48.73 31.11,50.16 39.37,50.16 39.69,50.48 39.69,70.48 J7.4
N$50
  Top 0.254: U1.78 30.08,48.66 31.27,49.85 39.69,49.85 40.01,50.16 40.01,68.26 J7.5
N$51
  Top 0.254: U1.77 30.48,48.58 31.43,49.53 40.01,49.53 40.32,49.85 40.32,66.2 J7.6
N$52
  Top 0.254: U1.76 30.88,48.5 31.59,49.21 40.16,49.21 40.64,49.69 40.64,63.82 J7.7
N$53
  Top 0.254: 41.91,84.45 41.91,90.96 41.27,91.6 33.23,91.6 JP1.CD2 | 40.8,84.45 41.91,84.45 | U1.84 27.68,48.52 27.3,48.9 27.3,50.16 28.73,51.59 36.99,51.59 38.42,53.02 38.42,74.45 40.8,76.83 40.8,80.17 41.91,81.28 41.91,84.45
  Top 0.61: R30.1 40.8,84.45
N$54
  Top 0.254: U1.91 24.88,50.6 27.78,53.5 36.04,53.5 36.51,53.98 36.51,72.55 31.27,77.79 27.78,77.79 26.83,78.74 26.83,81.08 JP1.8
N$55
  Top 0.254: U1.90 25.28,50.52 27.94,53.18 36.2,53.18 36.83,53.82 36.83,72.87 31.27,78.42 28.26,78.42 27.78,78.9 27.78,81.2 JP1.7
N$56
  Top 0.254: U1.89 25.68,50.45 28.1,52.86 36.35,52.86 37.15,53.66 37.15,73.18 30.16,80.17 30.16,81.03 JP1.5
N$57
  Top 0.254: U1.88 26.08,50.37 28.26,52.55 36.51,52.55 37.47,53.5 37.47,73.5 32.07,78.9 32.07,81.19 JP1.3
N$58
  Top 0.254: U1.87 26.48,50.3 28.42,52.23 36.67,52.23 37.78,53.34 37.78,74.3 33.34,78.74 33.34,81.37 JP1.2
N$59
  Top 0.254: U1.86 26.88,50.22 28.57,51.91 36.83,51.91 38.1,53.18 38.1,75.09 34.29,78.9 34.29,81.14 JP1.1
N$60
  Top 0.254: U1.130 14.1,36.7 12.7,38.1 4.29,38.1 3.49,38.89 3.49,40.8 COM2.4
N$61
  Top 0.254: U1.129 14.34,37.1 12.86,38.58 6.67,38.58 6.03,39.21 6.03,40.8 COM2.3
N$62
  Top 0.254: U1.128 14.73,37.5 13.18,39.05 9.68,39.05 8.41,40.32 COM2.2
N$63
  Top 0.254: R31.2 LED2.A
N$64
  Top 0.254: 14.13,29.37 15.86,31.1 U1.144
  Top 0.305: 14.13,29.37 13.34,29.37 R31.1
N$65
  Top 0.305: U1.1 18.08,27.93 13.49,23.34 J5.2
N$66
  Top 0.305: U1.2 18.48,27.37 15.72,24.61 15.72,23.5 J5.4
N$67
  Top 0.305: 18.25,23.49 J5.6 17.94,23.5 17.94,24.77 18.88,25.71 U1.3
N$68
  Top 0.305: U1.4 19.28,22.46 19.05,22.23 16.99,22.23 J5.3
N$69
  Top 0.305: U1.5 19.68,21.59 18.73,20.64 18.26,20.64 J5.5
N$70
  Top 0.254: U1.101 20.88,48.98 22.07,50.16 22.07,50.7 LED3.A
N$71  (via drill 0.5)
  Top 0.254: LED3.C 19.68,50.8 v19.21,51.28
  Bottom 0.254: v19.21,51.28 19.69,51.28 R32.2
N$72
  Top 0.254: U1.75 31.28,48.43 31.75,48.9 40.32,48.9 40.96,49.53 40.96,61.59 J7.8
NAND_CS
  Top 0.254: U1.32 30.48,26.98 33.97,23.5 33.97,19.34 IC5.1
NAND_HOLD
  Top 0.254: U1.35 31.68,27.69 35.88,23.5 35.88,21.11 36.2,20.8 40.48,20.8 41.43,19.84 41.43,17.94 41.91,17.46 IC5.7
NAND_SCLK
  Top 0.254: U1.34 31.28,27.45 35.4,23.34 35.4,20.48 35.56,20.32 40.01,20.32 40.96,19.37 40.96,16.51 41.27,16.19 IC5.6
NAND_SI
  Top 0.254: IC5.5 40.8,14.92 40.48,15.24 40.48,19.21 39.85,19.84 35.24,19.84 34.92,20.16 34.92,23.18 30.88,27.22 U1.33
NAND_SO
  Top 0.254: U1.31 30.08,26.75 33.02,23.81 33.02,17.78 33.34,17.46 33.94,17.46 IC5.2
NAND_WP
  Top 0.254: U1.30 29.68,26.52 32.38,23.81 32.38,16.83 33.02,16.19 33.94,16.19 IC5.3
PROGRAM  (via drill 0.5)
  Top 0.254: U1.13 22.88,30.3 | 22.88,30.3 22.7,30.48 21.75,30.48 21.68,30.41 U1.10 | v23.34,31.59 23.34,30.75 22.88,30.3
  Bottom 0.254: R25.2 23.34,30.48 v23.34,31.59 23.66,31.91 R29.1
RESET_N
  Top 0.254: S1.4 S1.3 41.28,8.09 C41.1 43.81,8.1 44.61,8.89 44.61,24.13 43.66,25.08 39.37,25.08 38.42,24.13 R28.1 38.1,22.86 38.26,23.02 36.99,23.02 32.08,27.93 U1.36
SCLK
  Top 0.254: U1.61 37.52,40.7 37.78,40.96 40.32,40.96 40.96,40.32 J6.3
SCLK1
  Top 0.254: U1.46 35.94,34.7 36.51,34.13 40.32,34.13 J9.3
SYSCLK
  Top 0.254: 27.46,57.47 IC2.8 24.48,54.11 U1.92
V+
  Top 0.254: U2.9 9.98,61.09 8.73,59.85 8.73,58.1 8.41,57.78 7.62,57.78 C35.1 | 16.35,70.64 16.35,70.48 16.67,70.17
  Top 0.61: IC6.8 13.02,69.69 13.97,70.64 16.35,70.64 | C35.1 7.3,55.24 7.16,55.15 6.83,54.93 | 16.51,70.81 16.51,73.03 16.03,73.5 3.49,73.5 1.75,71.75
  Top 0.813: L1.2 6.6,54.59 7.16,55.15 | 6.83,54.93 2.7,54.93 1.75,55.88 1.75,71.75
  Top 1.016: 16.51,70.81 16.51,70.33 16.67,70.17 17.3,69.53 17.3,68.89 C36.1
VCC_PLL0
  Top 0.254: C21.1 R5.2 14.94,45.1 U1.109
VCC_PLL1
  Top 0.254: U1.37 34.28,30.96 35.4,29.84 C20.1 35.24,28.74 R4.2
VCCINT  (via drill 0.5, 0.6)
  Top 0.254: v13.65,30.64 14.67,31.5 U1.143 18.01,31.5 18.41,31.91 | v13.34,35.88 13.68,35.9 U1.132 17.76,35.9 18.41,36.51 | v13.34,41.91 14.28,41.9 U1.117 17.79,41.9 | R5.1 12.07,45.4 v13.02,44.45 | U1.63 36.42,41.5 v36.51,41.59 | U1.47 36.81,35.1 | U1.38 35.49,31.5 v36.04,30.96
  Top 0.406: 37.47,26.98 37.31,26.98 | v36.04,30.96 36.67,30.32 36.67,28.1 37.31,27.46 37.31,26.98 | 37.31,26.98 37.3,26.98 R4.1
  Top 0.61: 45.72,34.77 37.31,34.77 v36.83,34.92 36.81,34.94 36.81,35.1
  Top 0.813: 17.79,41.9 18.41,41.27 | 45.72,40.96 45.4,41.59 v36.51,41.59 | 45.74,34.62 45.72,35.24 | 16.99,28.57 16.99,30 18.41,31.43
  Top 1.016: 18.41,41.27 18.41,36.51 18.41,31.91 18.41,31.43 | 45.72,27.15 45.72,1.91 44.93,1.11 31.59,1.11 30.96,1.75 30.96,11.43 30,12.38 27.72,12.38 L2.1 | 45.72,27.15 45.72,27.3 | 45.72,27.3 45.72,34.77 45.72,35.24 45.72,40.96 | C1.2 C27.2 19.68,12.06 R40.1 18.73,11.75 15.56,14.92 15.56,15.72 TP2.1 15.88,15.72 15.4,15.24 15.24,15.24 10.79,19.68 10.79,24.61 11.91,25.72 14.13,25.72 16.99,28.57 | 45.4,26.98 45.72,27.3 | R4.1 45.4,26.83 45.72,27.15
  Top 1.27: C1.2 27.21,12.06 L2.1
  Bottom 0.254: v13.34,35.88 C19.1 | C18.1 15.56,41.58 U1.117 13.66,41.9 v13.34,41.91 13.02,42.23 v13.02,44.45 | v36.51,41.59 C14.1 | 35.24,34.92 C15.1 | C16.1 35.56,31.43 v36.04,30.96
  Bottom 0.305: C17.1 13.81,30.48 v13.65,30.64
  Bottom 0.61: C15.1 36.35,34.77 v36.83,34.92
VQ
  Top 0.254: 12.22,65.88 IC6.5 13.49,65.88 14.29,65.25 14.29,63.02 14.61,62.71 15.88,62.71 16.19,62.39 16.19,53.98 16.03,53.82 13.34,53.82 12.54,54.61 12.54,54.93 C32.1 11.48,55.99 U2.5 | 12.22,65.88 11.75,65.88 10.48,67.15 IC6.3 | C34.1 11.27,64.93 12.22,65.88

### Text on the board
tPlace: TF Card | G +5 G | MCLK | SCLK | GND | TXD RXD GND | LRCLK | DI | DO | TXD RXD GND | TDI | TCK | TMS | GND | GND | TDO | TP2 1.2V | TP1 3.3V | Zhiyuan Wan | The GAIA Platform | Anlogic AL10K | MIDI Synthesizer | Nov.20 Rev.1